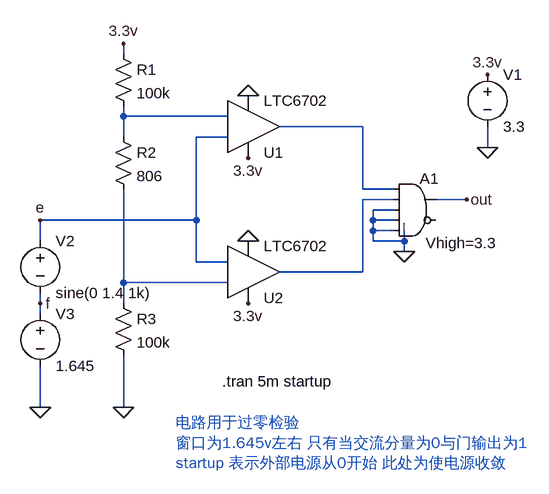
[diagram p0: schematic Draft1.asc]
Draft1.asc, the LTspice schematic file:
Version 4
SHEET 1 880 692
WIRE 192 64 192 48
WIRE 192 160 192 144
WIRE 352 160 192 160
WIRE 560 176 432 176
WIRE 192 192 192 160
WIRE 352 192 304 192
WIRE 752 208 752 176
WIRE 560 272 560 176
WIRE 608 272 560 272
WIRE 608 288 560 288
WIRE 720 288 672 288
WIRE 608 304 576 304
WIRE 304 320 304 192
WIRE 304 320 64 320
WIRE 576 320 576 304
WIRE 608 320 576 320
WIRE 576 336 576 320
WIRE 608 336 576 336
WIRE 64 352 64 320
WIRE 576 352 576 336
WIRE 624 352 624 336
WIRE 624 352 576 352
WIRE 624 368 624 352
WIRE 304 384 304 320
WIRE 352 384 304 384
WIRE 560 400 560 288
WIRE 560 400 432 400
WIRE 192 416 192 272
WIRE 352 416 192 416
WIRE 64 448 64 432
WIRE 192 448 192 416
WIRE 64 464 64 448
WIRE 64 608 64 544
WIRE 192 608 192 528
FLAG 624 368 0
FLAG 752 208 0
FLAG 752 96 3.3v
FLAG 384 352 0
FLAG 384 448 3.3v
FLAG 384 128 0
FLAG 384 224 3.3v
FLAG 192 608 0
FLAG 192 48 3.3v
FLAG 64 608 0
FLAG 720 288 out
FLAG 64 320 e
FLAG 64 448 f
SYMBOL Digital/and 640 240 R0
WINDOW 3 17 115 Left 2
SYMATTR InstName A1
SYMATTR Value Vhigh=3.3
SYMBOL Voltage 752 80 R0
SYMATTR InstName V1
SYMATTR Value 3.3
SYMBOL Comparators/LTC6702 384 400 M180
SYMATTR InstName U2
SYMBOL Comparators/LTC6702 384 176 M180
SYMATTR InstName U1
SYMBOL Res 176 48 R0
SYMATTR InstName R1
SYMATTR Value 100k
SYMBOL Res 176 432 R0
SYMATTR InstName R3
SYMATTR Value 100k
SYMBOL Voltage 64 336 R0
SYMATTR InstName V2
SYMATTR Value sine(0 1.4 1k)
SYMBOL Voltage 64 448 R0
SYMATTR InstName V3
SYMATTR Value 1.645
SYMBOL Res 176 176 R0
SYMATTR InstName R2
SYMATTR Value 806
TEXT 344 568 Left 2 !.tran 5m startup
TEXT 272 632 Left 2 ;电路用于过零检验\n窗口为1.645v左右 只有当交流分量为0与门输出为1\nstartup 表示外部电源从0开始 此处为使电源收敛

The netlist it stands for:
* Draft1.asc
A1 N002 N003 0 0 0 0 out 0 AND Vhigh=3.3
V1 3.3v 0 3.3
XU2 e N004 3.3v 0 N003 LTC6702
XU1 N001 e 3.3v 0 N002 LTC6702
R1 3.3v N001 100k
R3 N004 0 100k
V2 e f sine(0 1.4 1k)
V3 f 0 1.645
R2 N001 N004 806
.tran 5m startup
* 电路用于过零检验
* 窗口为1.645v左右 只有当交流分量为0与门输出为1
* startup 表示外部电源从0开始 此处为使电源收敛
.lib LTC3.lib
.backanno
.end